# Altium schematic sheet Overvoltage_protection_sheet.SchDoc: Overvoltage_protection
size A4; CheckedBy: Hildo / Joel / Luis; Author: Fellipe; Organization: UNICAMP / LCEE; Address1: University of Campinas - Brazil; Address2: Power Conditioning Laboratory; Address3: Licensed by GNU GPL 3.0; ProjectName: Easy Inverter
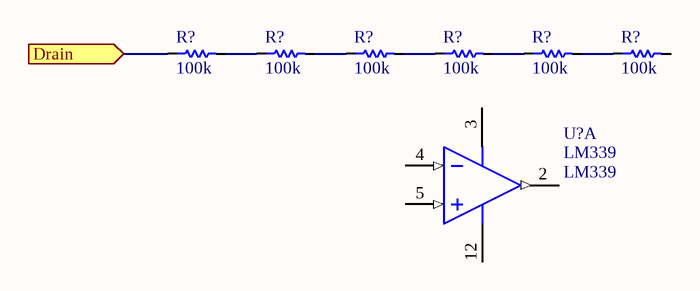
[diagram p0: Overvoltage_protection_sheet.SchDoc]

## Parts
(Parts that share a designator on the sheet are numbered #1, #2 ... from top to bottom, then left to right.)
R?#1  value 100k  [Resistor 0805]  (hidden comment: Resistor 0805)
R?#2  value 100k  [Resistor 0805]  (hidden comment: Resistor 0805)
R?#3  value 100k  [Resistor 0805]  (hidden comment: Resistor 0805)
R?#4  value 100k  [Resistor 0805]  (hidden comment: Resistor 0805)
R?#5  value 100k  [Resistor 0805]  (hidden comment: Resistor 0805)
R?#6  value 100k  [Resistor 0805]  (hidden comment: Resistor 0805)
U?  LM339  [SOIC 14]  (part A of 4)

## Ports
Drain (in)

## Nets
Drain: R?#1.1 ; port Drain
NetR?#1_2: R?#1.2 R?#2.1
NetR?#2_2: R?#2.2 R?#3.1
NetR?#3_2: R?#3.2 R?#4.1
NetR?#4_2: R?#4.2 R?#5.1
NetR?#5_2: R?#5.2 R?#6.1

Not connected (* = marked no-connect by the designer): R?#6 2; U? 2(OUT1) 3(V+) 4(IN1-) 5(IN1+) 12(GND)

## Notes on the sheet
- Title
- Author
- Revisor
- Hildo G Jr
- Revision:
- Sheet
- of
- File:
- Size:
- A4
- HGJr

## Library data of the parts
R?#1-R?#6 = Resistor 0805: SMD resistor 0805; pn: undefined
U? = LM339: Low Power Low Offset Voltage Quad Comparator, 14-pin Narrow SOIC; PN: LM339DT; ComponentLink1Description: Manufacturer URL; ComponentLink1URL: http://www.national.com/; ComponentLink2Description: LM339 Datasheet; ComponentLink2URL: http://www.national.com/ds/LM/LM339.pdf; ComponentLink3Description: LM339 Web Page; ComponentLink3URL: http://www.national.com/pf/LM/LM339.html; ComponentLink4Description: M14A Package Page; ComponentLink4URL: http://www.national.com/packaging/folders/m14a.html; Value: LM339